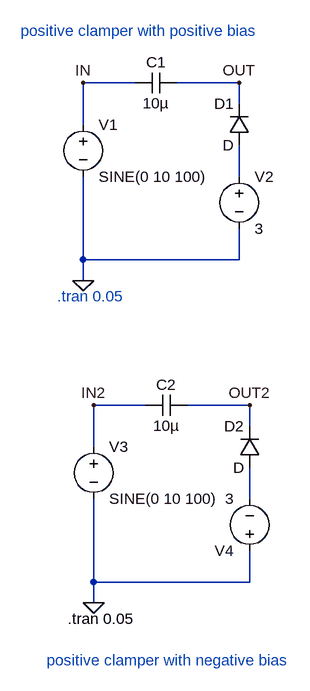
[diagram p0: schematic Positive__clamper_with_bias.asc]
Positive__clamper_with_bias.asc, the LTspice schematic file:
Version 4.1
SHEET 1 880 952
WIRE 192 48 112 48
WIRE 352 48 256 48
WIRE 352 80 352 48
WIRE 112 112 112 48
WIRE 352 192 352 144
WIRE 112 320 112 192
WIRE 352 320 352 272
WIRE 352 320 112 320
WIRE 112 352 112 320
WIRE 208 544 128 544
WIRE 368 544 272 544
WIRE 368 576 368 544
WIRE 128 608 128 544
WIRE 368 688 368 640
WIRE 128 816 128 688
WIRE 368 816 368 768
WIRE 368 816 128 816
WIRE 128 848 128 816
FLAG 112 352 0
FLAG 112 48 IN
FLAG 352 48 OUT
FLAG 128 848 0
FLAG 128 544 IN2
FLAG 368 544 OUT2
SYMBOL voltage 112 96 R0
WINDOW 123 0 0 Left 0
WINDOW 39 0 0 Left 0
SYMATTR InstName V1
SYMATTR Value SINE(0 10 100)
SYMBOL cap 256 32 R90
WINDOW 0 0 32 VBottom 2
WINDOW 3 32 32 VTop 2
SYMATTR InstName C1
SYMATTR Value 10µ
SYMBOL diode 368 144 R180
WINDOW 0 24 64 Left 2
WINDOW 3 24 0 Left 2
SYMATTR InstName D1
SYMBOL voltage 352 176 R0
WINDOW 123 0 0 Left 0
WINDOW 39 0 0 Left 0
SYMATTR InstName V2
SYMATTR Value 3
SYMBOL voltage 128 592 R0
WINDOW 123 0 0 Left 0
WINDOW 39 0 0 Left 0
SYMATTR InstName V3
SYMATTR Value SINE(0 10 100)
SYMBOL cap 272 528 R90
WINDOW 0 0 32 VBottom 2
WINDOW 3 32 32 VTop 2
SYMATTR InstName C2
SYMATTR Value 10µ
SYMBOL diode 384 640 R180
WINDOW 0 24 64 Left 2
WINDOW 3 24 0 Left 2
SYMATTR InstName D2
SYMBOL voltage 368 784 R180
WINDOW 123 0 0 Left 0
WINDOW 39 0 0 Left 0
SYMATTR InstName V4
SYMATTR Value 3
TEXT 72 376 Left 2 ;.tran 0.05
TEXT 88 872 Left 2 !.tran 0.05
TEXT 16 -32 Left 2 ;positive clamper with positive bias
TEXT 56 936 Left 2 ;positive clamper with negative bias

The netlist it stands for:
* Positive__clamper_with_bias.asc
V1 IN 0 SINE(0 10 100)
C1 OUT IN 10µ
D1 N001 OUT D
V2 N001 0 3
V3 IN2 0 SINE(0 10 100)
C2 OUT2 IN2 10µ
D2 N002 OUT2 D
V4 0 N002 3
.model D D
.lib standard.dio
* .tran 0.05
.tran 0.05
* positive clamper with positive bias
* positive clamper with negative bias
.backanno
.end

* Results of the author's LTspice run, read from the files saved beside the schematic
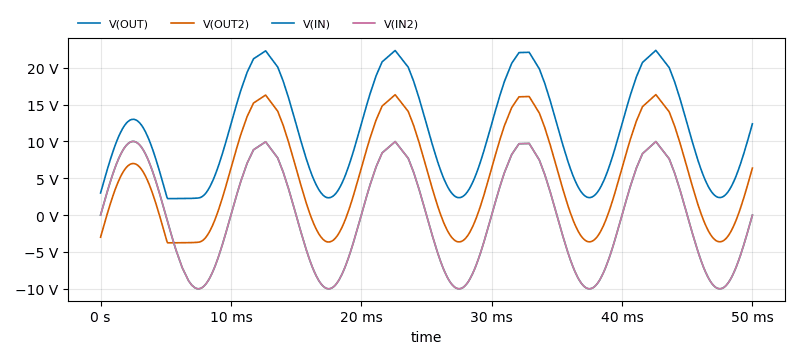
[diagram p1: Transient Analysis of Positive__clamper_with_bias.asc, plotted from the saved traces]
* Transient Analysis, 1 run:
*   V(OUT): min 2.236 V, max 22.35 V, average 11.19 V, rms 13.14 V, last 12.38 V
*   V(OUT2): min -3.764 V, max 16.35 V, average 5.19 V, rms 8.625 V, last 6.38 V
*   V(IN): min -10 V, max 9.994 V, average -47.46 mV, rms 7.028 V, last 0 V
*   V(IN2): min -10 V, max 9.994 V, average -47.46 mV, rms 7.028 V, last 0 V